# EAGLE design replicape-display (EAGLE 5.12)
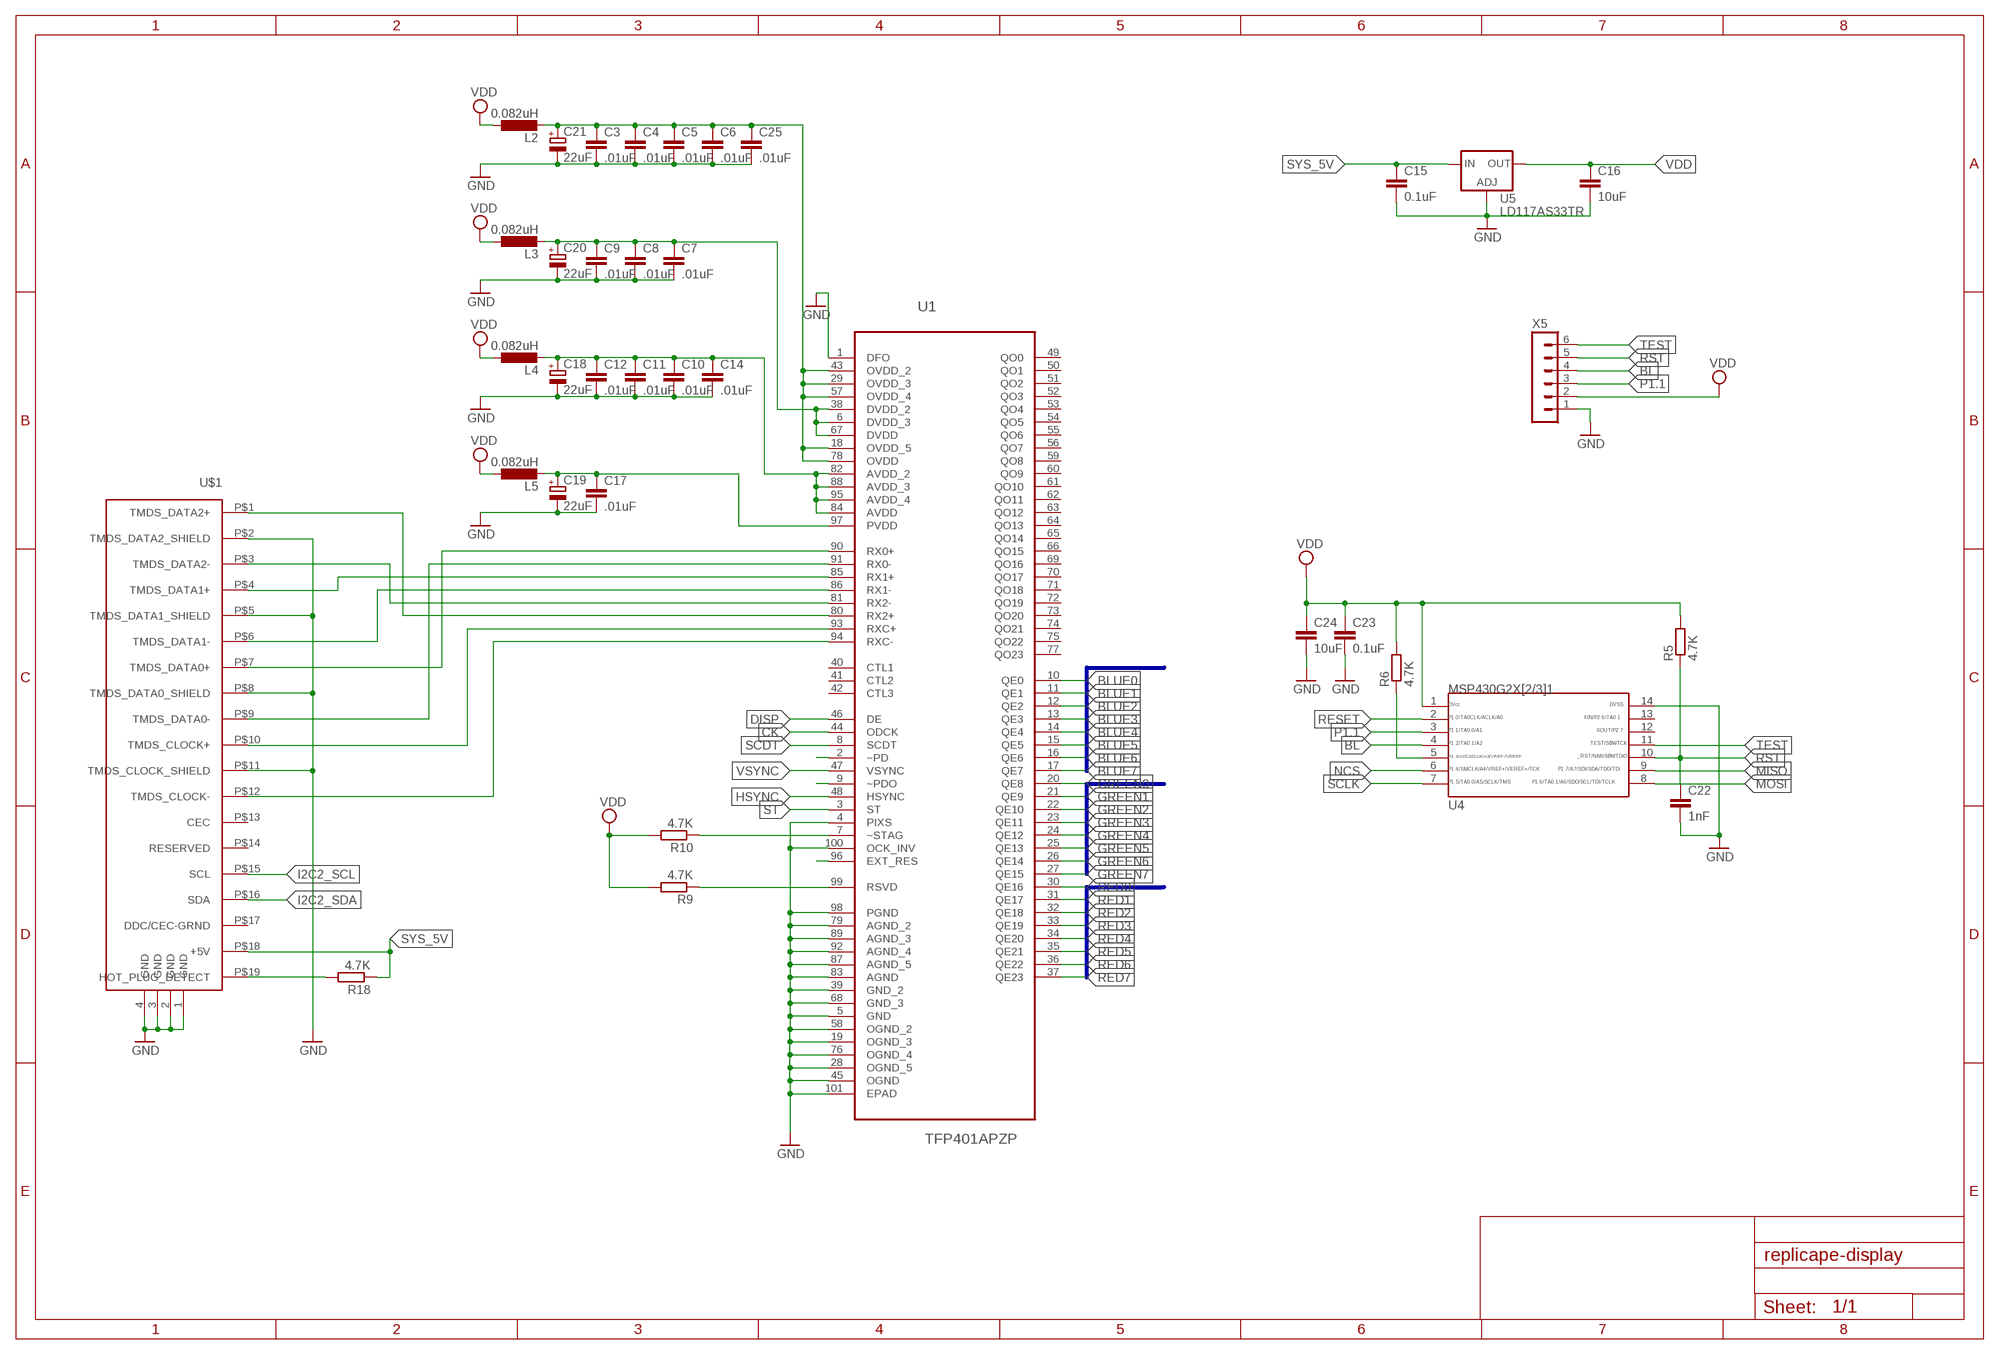
[diagram p0: schematic, sheet 1, part 1 of 2]
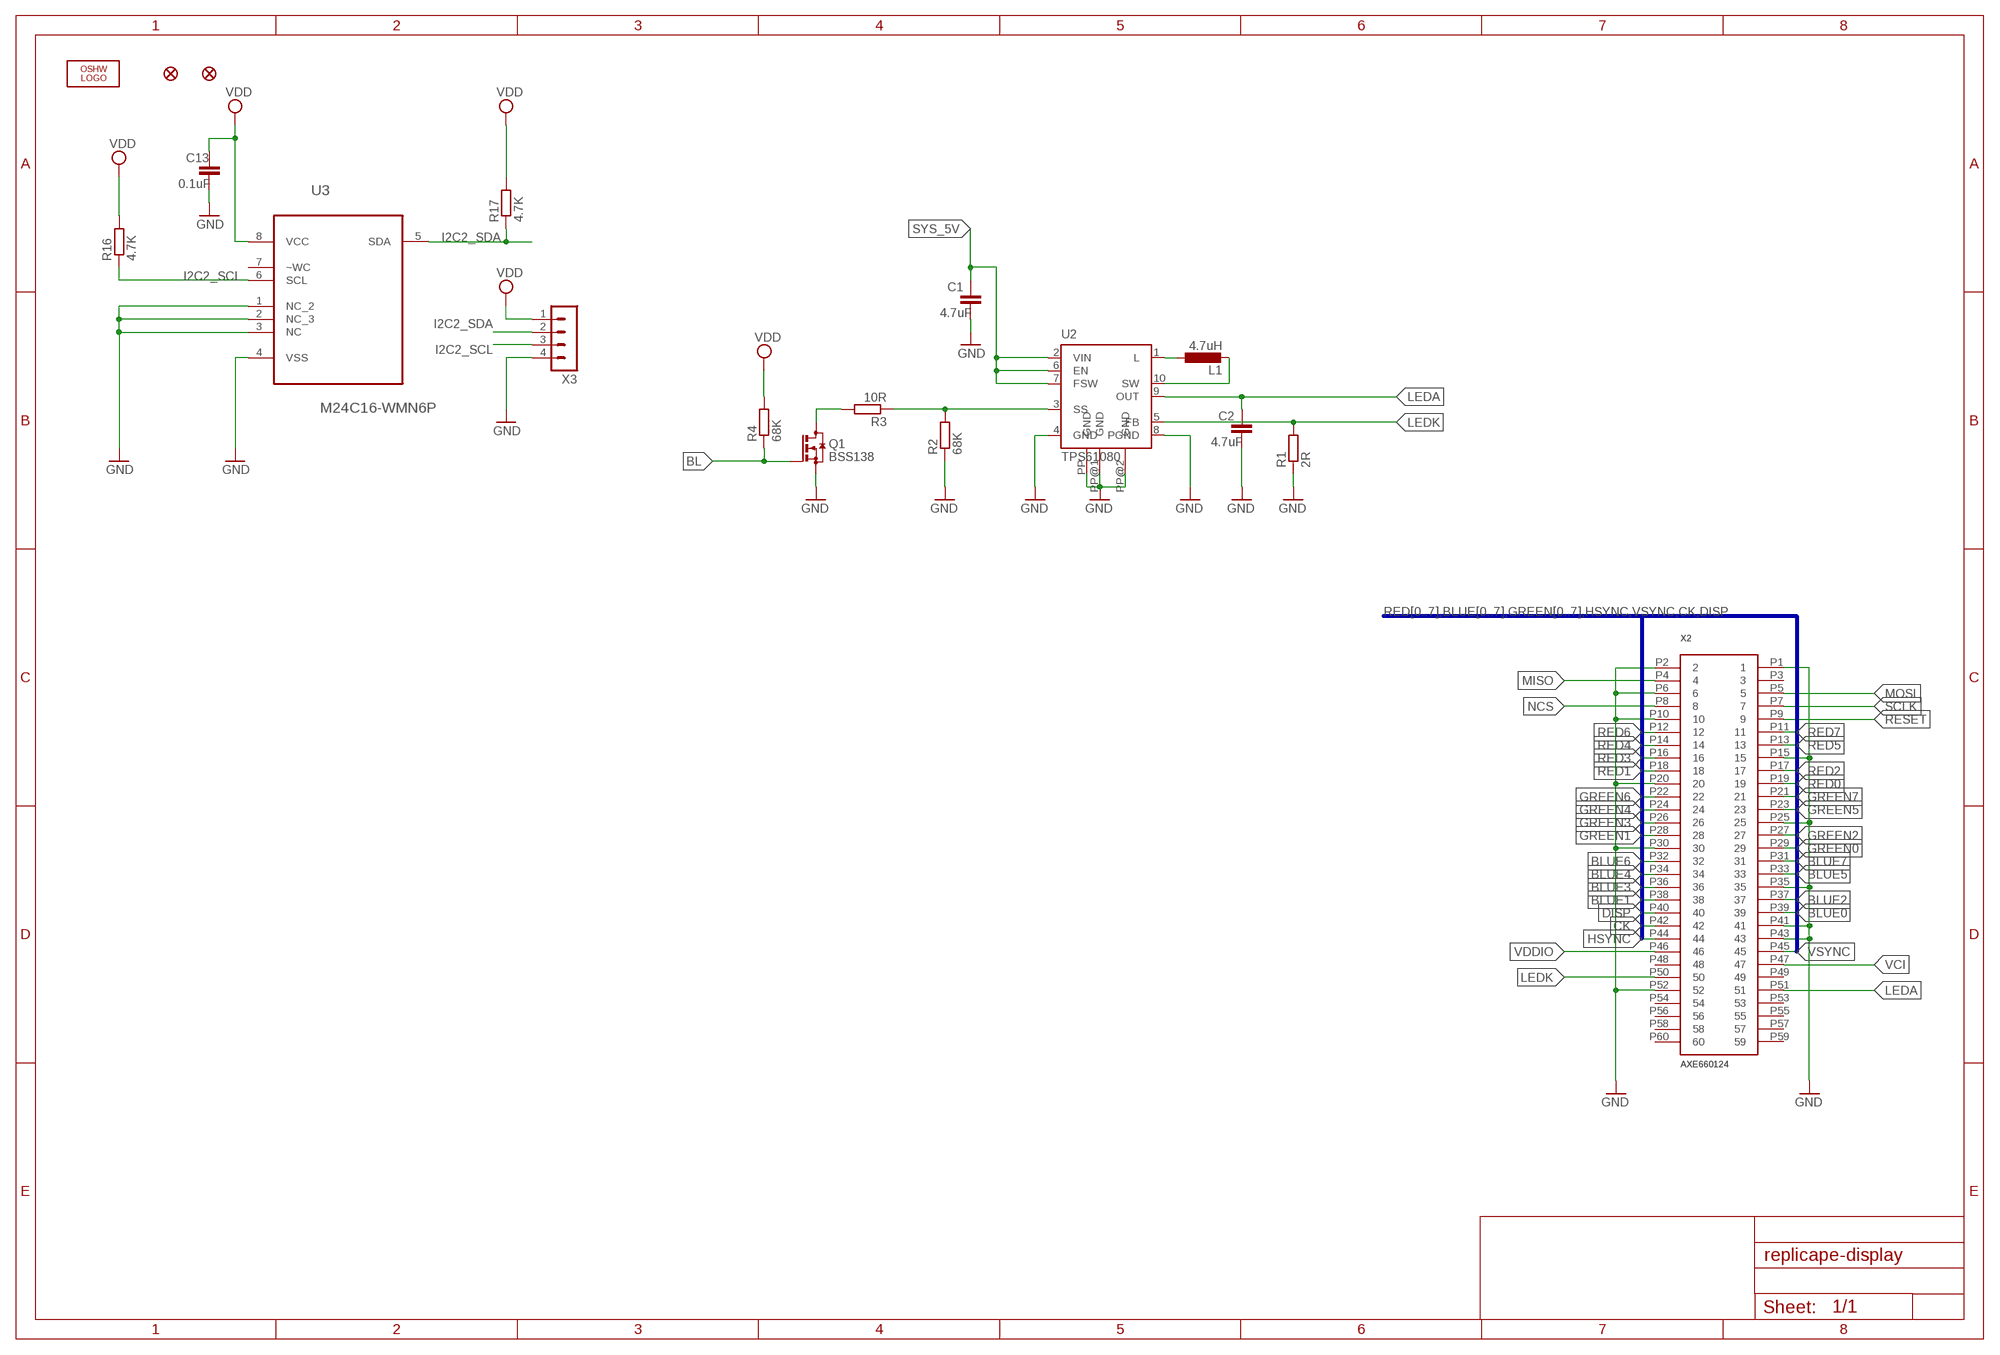
[diagram p1: schematic, sheet 1, part 2 of 2]

## Parts
C1  4.7uF  C-EUC0402  [C0402]
C2  4.7uF  C-EUC0402  [C0402]
C3  .01uF  C-EUC0402  [C0402]
C4  .01uF  C-EUC0402  [C0402]
C5  .01uF  C-EUC0402  [C0402]
C6  .01uF  C-EUC0402  [C0402]
C7  .01uF  C-EUC0402  [C0402]
C8  .01uF  C-EUC0402  [C0402]
C9  .01uF  C-EUC0402  [C0402]
C10  .01uF  C-EUC0402  [C0402]
C11  .01uF  C-EUC0402  [C0402]
C12  .01uF  C-EUC0402  [C0402]
C13  0.1uF  C-EUC0402  [C0402]
C14  .01uF  C-EUC0402  [C0402]
C15  0.1uF  C-EUC0402  [C0402]
C16  10uF  C-EUC0805  [C0805]
C17  .01uF  C-EUC0402  [C0402]
C18  22uF  CPOL-EUCT3216  [CT3216]
C19  22uF  CPOL-EUCT3216  [CT3216]
C20  22uF  CPOL-EUCT3216  [CT3216]
C21  22uF  CPOL-EUCT3216  [CT3216]
C22  1nF  C-EUC0402  [C0402]
C23  0.1uF  C-EUC0402  [C0402]
C24  10uF  C-EUC0402  [C0402]
C25  .01uF  C-EUC0402  [C0402]
JP1  FIDUCIAL1X2  [FIDUCIAL-1X2]
JP2  FIDUCIAL1X2  [FIDUCIAL-1X2]
L1  4.7uH  L-EUL2825P  [L2825P]
L2  0.082uH  L-EUL2012C  [L2012C]
L3  0.082uH  L-EUL2012C  [L2012C]
L4  0.082uH  L-EUL2012C  [L2012C]
L5  0.082uH  L-EUL2012C  [L2012C]
LOGO1  OSHW_LOGO_10MILX0500-NT  [OSHW_10X500_NOTEXT]
Q1  BSS138  BSS123  [SOT23]
R1  2R  R-EU_R0402  [R0402]
R2  68K  R-EU_R0402  [R0402]
R3  10R  R-EU_R0402  [R0402]
R4  68K  R-EU_R0402  [R0402]
R5  4.7K  R-EU_R0402  [R0402]
R6  4.7K  R-EU_R0402  [R0402]
R9  4.7K  R-EU_R0402  [R0402]
R10  4.7K  R-EU_R0402  [R0402]
R16  4.7K  R-EU_R0402  [R0402]
R17  4.7K  R-EU_R0402  [R0402]
R18  4.7K  R-EU_R0402  [R0402]
U1  TFP401APZP  [QFP50P1600X1600X120-101N]
U2  TPS61080  [S-PDSO-N10]
U3  M24C16-WMN6P  [SOIC127P600X175-8N]
U4  G2X[2/3]1---PW14  [PW14]
U5  LD117AS33TR  [SOT223]
U$1  HDMI  [FCI-HDMI]
X2  AXE660124  AXE660124SOCKET  [AXE560124]
X3  MA04-1  [MA04-1]
X5  MA06-1  [MA06-1]

## Nets
BL: Q1.1(G) R4.1 U4.4 X5.4
BLUE0: U1.10(QE0) X2.P39
BLUE1: U1.11(QE1) X2.P38
BLUE2: U1.12(QE2) X2.P37
BLUE3: U1.13(QE3) X2.P36
BLUE4: U1.14(QE4) X2.P34
BLUE5: U1.15(QE5) X2.P33
BLUE6: U1.16(QE6) X2.P32
BLUE7: U1.17(QE7) X2.P31
CK: U1.44(ODCK) X2.P42
DISP: U1.46(DE) X2.P40
GND: C1.2 C2.2 C3.2 C4.2 C5.2 C6.2 C7.2 C8.2 C9.2 C10.2 C11.2 C12.2 C13.2 C14.2 C15.2 C16.2 C17.2 C18.- C19.- C20.- C21.- C22.2 C23.2 C24.2 C25.2 Q1.2(S) R1.1 R2.1 U1.1(DFO) U1.4(PIXS) U1.5(GND) U1.19(OGND_3) U1.28(OGND_5) U1.39(GND_2) U1.45(OGND) U1.58(OGND_2) U1.68(GND_3) U1.76(OGND_4) U1.79(AGND_2) U1.83(AGND) U1.87(AGND_5) U1.89(AGND_3) U1.92(AGND_4) U1.98(PGND) U1.100(OCK_INV) U1.101(EPAD) U2.4(GND) U2.8(PGND) U2.PP(GND) U2.PP@1(GND) U2.PP@2(GND) U3.1(NC_2) U3.2(NC_3) U3.3(NC) U3.4(VSS) U4.14 U5.1(ADJ) U$1.1(GND) U$1.2(GND) U$1.3(GND) U$1.4(GND) U$1.P$2(TMDS_DATA2_SHIELD) U$1.P$5(TMDS_DATA1_SHIELD) U$1.P$8(TMDS_DATA0_SHIELD) U$1.P$11(TMDS_CLOCK_SHIELD) X2.P1 X2.P2 X2.P6 X2.P10 X2.P15 X2.P20 X2.P25 X2.P30 X2.P35 X2.P41 X2.P43 X2.P52 X3.4 X5.1
GREEN0: U1.20(QE8) X2.P29
GREEN1: U1.21(QE9) X2.P28
GREEN2: U1.22(QE10) X2.P27
GREEN3: U1.23(QE11) X2.P26
GREEN4: U1.24(QE12) X2.P24
GREEN5: U1.25(QE13) X2.P23
GREEN6: U1.26(QE14) X2.P22
GREEN7: U1.27(QE15) X2.P21
HSYNC: U1.48(HSYNC) X2.P44
I2C2_SCL: R16.1 U3.6(SCL) U$1.P$15(SCL) X3.3
I2C2_SDA: R17.1 U3.5(SDA) U$1.P$16(SDA) X3.2
LEDA: C2.1 U2.9(OUT) X2.P51
LEDK: R1.2 U2.5(FB) X2.P50
MISO: U4.9 X2.P4
MOSI: U4.8 X2.P5
N$1: L1.1 U2.1(L)
N$2: L1.2 U2.10(SW)
N$3: U1.2(~PD)
N$4: R2.2 R3.1 U2.3(SS)
N$5: U1.9(~PDO)
N$6: Q1.3(D) R3.2
N$9: R6.1 U4.5
N$10: R10.1 U1.7(~STAG)
N$11: R9.1 U1.99(RSVD)
N$19: C7.1 C8.1 C9.1 C20.+ L3.2 U1.6(DVDD_3) U1.38(DVDD_2) U1.67(DVDD)
N$20: C3.1 C4.1 C5.1 C6.1 C21.+ C25.1 L2.2 U1.18(OVDD_5) U1.29(OVDD_3) U1.43(OVDD_2) U1.57(OVDD_4) U1.78(OVDD)
N$21: C10.1 C11.1 C12.1 C14.1 C18.+ L4.2 U1.82(AVDD_2) U1.84(AVDD) U1.88(AVDD_3) U1.95(AVDD_4)
N$22: C17.1 C19.+ L5.2 U1.97(PVDD)
N$23: U1.96(EXT_RES)
N$31: R18.2 U$1.P$19(HOT_PLUG_DETECT)
NCS: U4.6 X2.P8
P1.1: U4.3 X5.3
RED0: U1.30(QE16) X2.P19
RED1: U1.31(QE17) X2.P18
RED2: U1.32(QE18) X2.P17
RED3: U1.33(QE19) X2.P16
RED4: U1.34(QE20) X2.P14
RED5: U1.35(QE21) X2.P13
RED6: U1.36(QE22) X2.P12
RED7: U1.37(QE23) X2.P11
RESET: U4.2 X2.P9
RST: C22.1 R5.1 U4.10 X5.5
SCDT: U1.8(SCDT)
SCLK: U4.7 X2.P7
ST: U1.3(ST)
SYS_5V: C1.1 C15.1 R18.1 U2.2(VIN) U2.6(EN) U2.7(FSW) U5.3(IN) U$1.P$18(+5V)
TEST: U4.11 X5.6
TMDS_CLOCK+: U1.93(RXC+) U$1.P$10(TMDS_CLOCK+)
TMDS_CLOCK-: U1.94(RXC-) U$1.P$12(TMDS_CLOCK-)
TMDS_DATA0+: U1.90(RX0+) U$1.P$7(TMDS_DATA0+)
TMDS_DATA0-: U1.91(RX0-) U$1.P$9(TMDS_DATA0-)
TMDS_DATA1+: U1.85(RX1+) U$1.P$4(TMDS_DATA1+)
TMDS_DATA1-: U1.86(RX1-) U$1.P$6(TMDS_DATA1-)
TMDS_DATA2+: U1.80(RX2+) U$1.P$1(TMDS_DATA2+)
TMDS_DATA2-: U1.81(RX2-) U$1.P$3(TMDS_DATA2-)
VCI: X2.P47
VDD: C13.1 C16.1 C23.1 C24.1 L2.1 L3.1 L4.1 L5.1 R4.2 R5.2 R6.2 R9.2 R10.2 R16.2 R17.2 U3.8(VCC) U4.1 U5.4(OUT) X3.1 X5.2
VDDIO: X2.P46
VSYNC: U1.47(VSYNC) X2.P45
Unconnected: U1.40(CTL1) U1.41(CTL2) U1.42(CTL3) U1.49(QO0) U1.50(QO1) U1.51(QO2) U1.52(QO3) U1.53(QO4) U1.54(QO5) U1.55(QO6) U1.56(QO7) U1.59(QO8) U1.60(QO9) U1.61(QO10) U1.62(QO11) U1.63(QO12) U1.64(QO13) U1.65(QO14) U1.66(QO15) U1.69(QO16) U1.70(QO17) U1.71(QO18) U1.72(QO19) U1.73(QO20) U1.74(QO21) U1.75(QO22) U1.77(QO23) U3.7(~WC) U4.12 U4.13 U$1.P$13(CEC) U$1.P$14(RESERVED) U$1.P$17(DDC/CEC-GRND) X2.P3 X2.P48 X2.P49 X2.P53 X2.P54 X2.P55 X2.P56 X2.P57 X2.P58 X2.P59 X2.P60

## Buses
RED[0..7],BLUE[0..7],GREEN[0..7],HSYNC,VSYNC,CK,DISP
RED[0..7]
GREEN[0..7]
BLUE[0..7]

## Library data of the parts
C1-C17 C22-C25 = rcl:C-EU: CAPACITOR, European symbol
C18-C21 = rcl:CPOL-EU: POLARIZED CAPACITOR, European symbol
JP1 JP2 = SparkFun:FIDUCIAL: Fiducial Alignment Points Various fiducial points for machine vision alignment.
L1-L5 = rcl:L-EU: INDUCTOR, European symbol
LOGO1 = ohw-logo:OSHW_LOGO_10MIL
Q1 = transistor-small-signal:BSS123: N-CHANNEL MOS FET
R1-R6 R9 R10 R16-R18 = rcl:R-EU_: RESISTOR, European symbol
U1 = ti-tfp401:TFP401APZP: DIGITAL RECEIVER; MPN: TFP401APZP; OC_FARNELL: 1470430; OC_NEWARK: 74K3959; PACKAGE: QFP-100; SUPPLIER: TEXAS INSTRUMENTS
U2 = texas:TPS6108*: HIGH VOLTAGE DC/DC BOOST CONVERTER WITH 0.5-A/1.3-A INTEGRATED SWITCH Source: www.ti.com .. tps61081[1].pdf; MPN: TPS61080DRCT; OC_FARNELL: 1412517; OC_NEWARK: 30M1831
U3 = custom:M24C16-WMN6P: serial I²C bus EEPROM; MPN: M24C16-WMN6P; OC_FARNELL: 9882774; OC_NEWARK: 24M5071; PACKAGE: SOIC-8; SUPPLIER: STMicroelectronics
U4 = TI_MSP430_v16:G2X[2/3]1---PW14: MSP430G2X[2/3]1 TSSOP (PW) 14 Pin Package http://focus.ti.com/docs/prod/folders/print/msp430g2221.html MSP430G2121, MSP430G2221, MSP430G2131
U5 = v-reg:LD117A?*: Low drop fixed and adjustable positive voltage regulators 1 A Source: http://www.st.com/stonline/products/literature/ds/7194/ld1117axx.pdf
U$1 = hdmi:HDMI
X2 = replicape-display:AXE660124
X3 = con-lstb:MA04-1: PIN HEADER; OC_FARNELL: unknown; OC_NEWARK: unknown
X5 = con-lstb:MA06-1: PIN HEADER; OC_FARNELL: unknown; OC_NEWARK: unknown

## Board
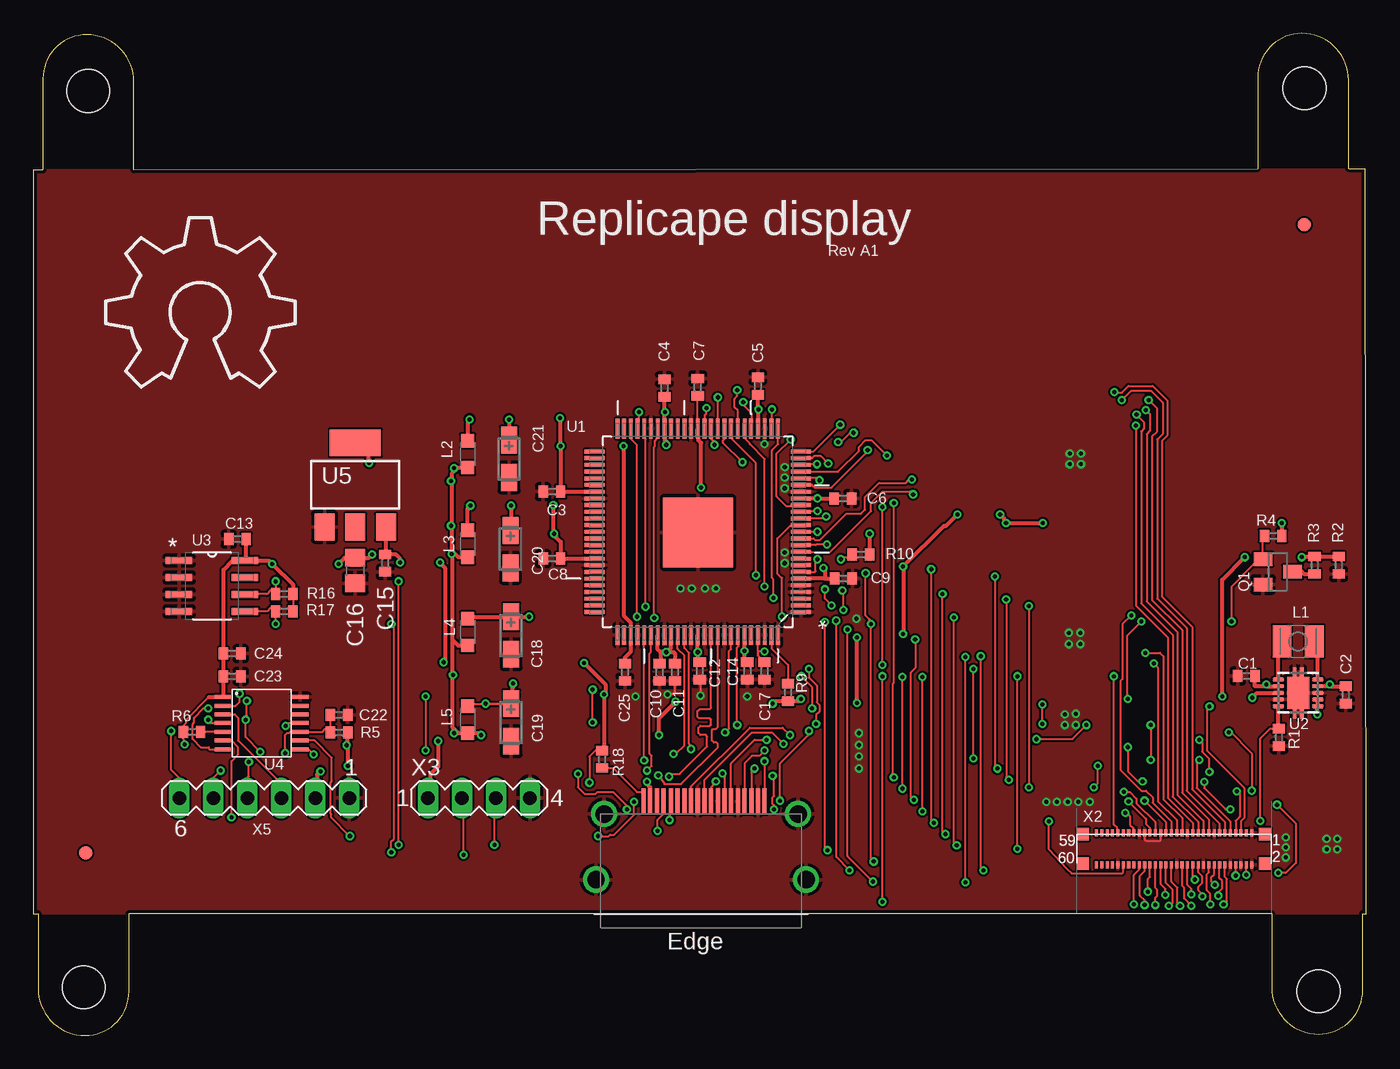
[diagram p2: board, top side]
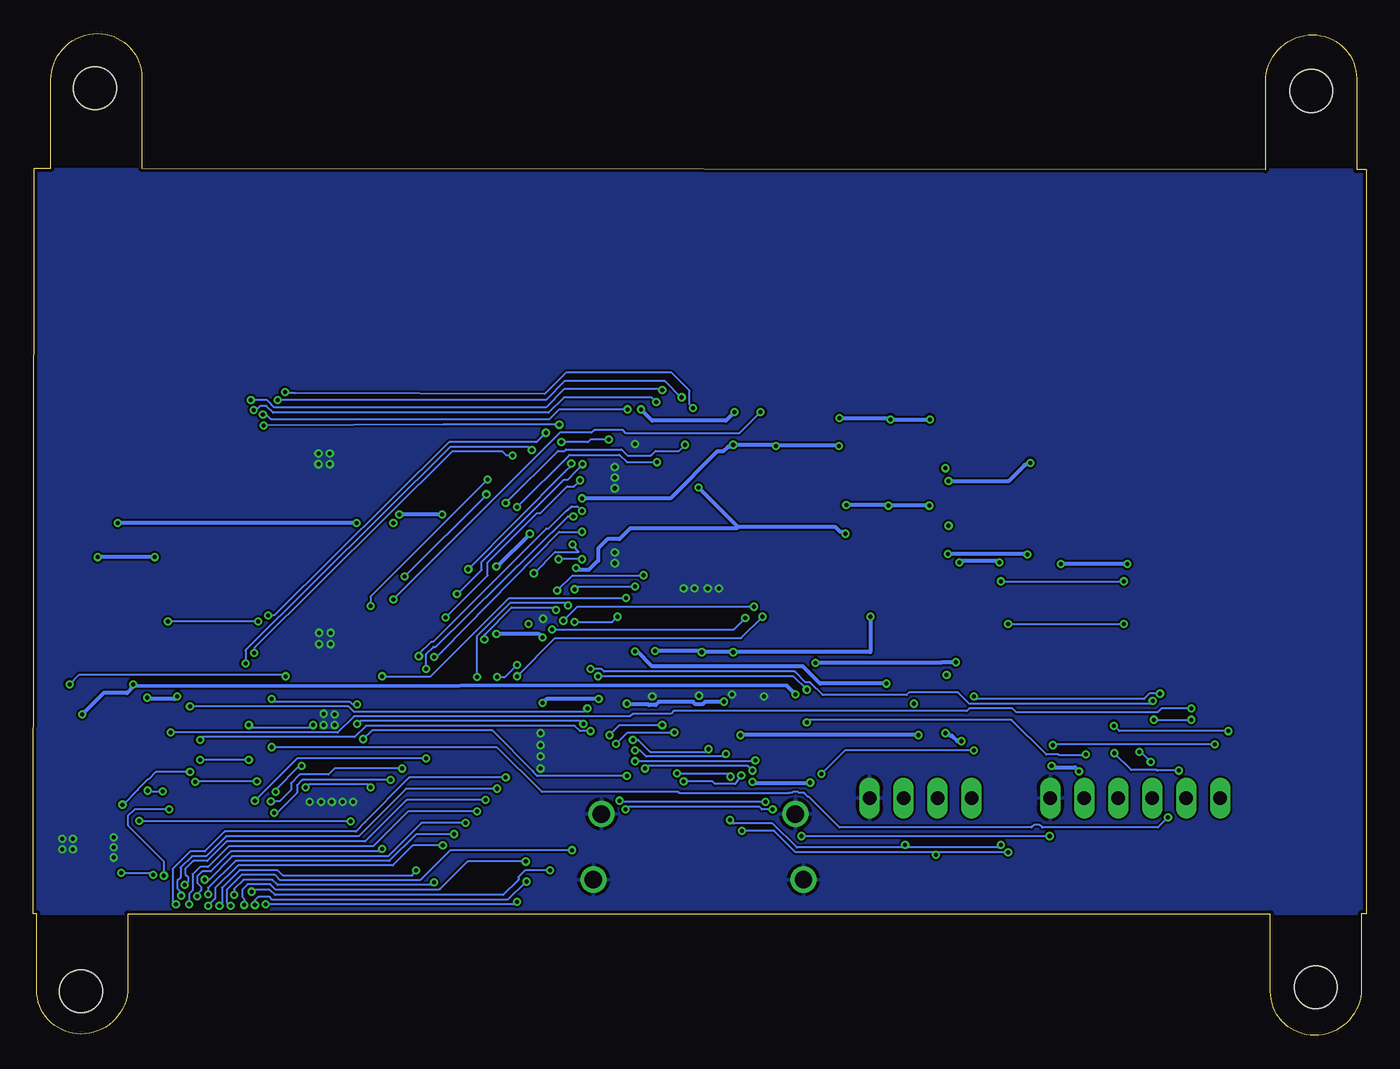
[diagram p3: board, bottom side, seen from below]

Size 99.6 x 74.9 mm. Coordinates in mm from the lower left corner, seen from the top.
Outline: 0,9.1 0.35,9.1 0.35,3.5 arc90 3.85,0 arc90 7.15,3.3 7.15,9.1 92.55,9.1 92.55,3.6 arc90 96.05,0.1 arc90 99.35,3.4 99.35,9.1 99.6,9.1 99.55,64.8 98.3,64.8 98.3,71.4 arc90 94.8,74.9 arc90 91.5,71.6 91.5,64.8 7.5,64.7 7.5,71.3 arc90 4,74.8 arc90 0.7,71.5 0.7,64.7 0,64.7 0,9.1
Copper layers (1*16): Top 0.035mm / dielectric 1.5mm / Bottom 0.035mm
Design rules "Fusion_eagle_rule_v1.1": minimum track width 6mil, minimum drill 12mil, track to track 6mil, track to pad 6mil, pad to pad 6mil, via to via 6mil, smd to smd 0mil, copper to edge 10mil, drill to drill 10mil, minimum pad ring 10mil, minimum via ring 6mil, stop-mask expansion 2mil, vias tented up to drill 100mil, thermal gap 10mil
Holes 3.2 mm at 4.1,70.6 3.75,3.6 95,70.8 96.05,3.3

### Footprints (pad centres in the part's own frame; a part is rotated, then mirrored left to right if it is on the bottom)
C0402 = smd 0.7 x 0.9: 1 -0.65,0; 2 0.65,0
C0805 = smd 1.3 x 1.5: 1 -0.95,0; 2 0.95,0
CT3216 = smd 2 x 1.2: + -1.4,0; - 1.4,0
FIDUCIAL-1X2 = smd 1 x 1: 1 0,0
L2825P = smd 1.4 x 2.4: 1 -1.2,0; 2 1.2,0
L2012C = smd 1 x 1: 1 -1,0; 2 1,0
SOT23 = smd 1 x 1.4: 1 -0.95,-1.1; 2 0.95,-1.1; 3 0,1.1
R0402 = smd 0.7 x 0.9: 1 -0.65,0; 2 0.65,0
QFP50P1600X1600X120-101N = smd 1.473 x 0.279: 1 -7.722,5.994; 2 -7.722,5.512; 3 -7.722,5.004; 4 -7.722,4.496; 5 -7.722,3.988; 6 -7.722,3.505; 7 -7.722,2.997; 8 -7.722,2.489; 9 -7.722,2.007; 10 -7.722,1.499; 11 -7.722,0.991; 12 -7.722,0.508; 13 -7.722,0; 14 -7.722,-0.508; 15 -7.722,-0.991; 16 -7.722,-1.499; 17 -7.722,-2.007; 18 -7.722,-2.489; 19 -7.722,-2.997; 20 -7.722,-3.505; 21 -7.722,-3.988; 22 -7.722,-4.496; 23 -7.722,-5.004; 24 -7.722,-5.512; 25 -7.722,-5.994; 51 7.722,-5.994; 52 7.722,-5.512; 53 7.722,-5.004; 54 7.722,-4.496; 55 7.722,-3.988; 56 7.722,-3.505; 57 7.722,-2.997; 58 7.722,-2.489; 59 7.722,-2.007; 60 7.722,-1.499; 61 7.722,-0.991; 62 7.722,-0.508; 63 7.722,0; 64 7.722,0.508; 65 7.722,0.991; 66 7.722,1.499; 67 7.722,2.007; 68 7.722,2.489; 69 7.722,2.997; 70 7.722,3.505; 71 7.722,3.988; 72 7.722,4.496; 73 7.722,5.004; 74 7.722,5.512; 75 7.722,5.994 | smd 0.279 x 1.473: 26 -5.994,-7.722; 27 -5.512,-7.722; 28 -5.004,-7.722; 29 -4.496,-7.722; 30 -3.988,-7.722; 31 -3.505,-7.722; 32 -2.997,-7.722; 33 -2.489,-7.722; 34 -2.007,-7.722; 35 -1.499,-7.722; 36 -0.991,-7.722; 37 -0.508,-7.722; 38 0,-7.722; 39 0.508,-7.722; 40 0.991,-7.722; 41 1.499,-7.722; 42 2.007,-7.722; 43 2.489,-7.722; 44 2.997,-7.722; 45 3.505,-7.722; 46 3.988,-7.722; 47 4.496,-7.722; 48 5.004,-7.722; 49 5.512,-7.722; 50 5.994,-7.722; 76 5.994,7.722; 77 5.512,7.722; 78 5.004,7.722; 79 4.496,7.722; 80 3.988,7.722; 81 3.505,7.722; 82 2.997,7.722; 83 2.489,7.722; 84 2.007,7.722; 85 1.499,7.722; 86 0.991,7.722; 87 0.508,7.722; 88 0,7.722; 89 -0.508,7.722; 90 -0.991,7.722; 91 -1.499,7.722; 92 -2.007,7.722; 93 -2.489,7.722; 94 -2.997,7.722; 95 -3.505,7.722; 96 -3.988,7.722; 97 -4.496,7.722; 98 -5.004,7.722; 99 -5.512,7.722; 100 -5.994,7.722 | smd 5.207 x 5.207: 101 -0.025,0.051
S-PDSO-N10 = smd 0.28 x 0.85: 1 -1,-1.475; 2 -0.5,-1.475; 3 0,-1.475; 4 0.5,-1.475; 5 1,-1.475; 6 1,1.475; 7 0.5,1.475; 8 0,1.475; 9 -0.5,1.475; 10 -1,1.475 | smd 2.4 x 1.65: PP 0,0 | smd 3.8 x 0.28: PP@1 0,0.275; PP@2 0,-0.275
SOIC127P600X175-8N = smd 1.981 x 0.533: 1 -2.464,1.905; 2 -2.464,0.635; 3 -2.464,-0.635; 4 -2.464,-1.905; 5 2.464,-1.905; 6 2.464,-0.635; 7 2.464,0.635; 8 2.464,1.905
PW14 = smd 0.3 x 1.2: 1 -1.95,-2.9; 2 -1.3,-2.9; 3 -0.65,-2.9; 4 0,-2.9; 5 0.65,-2.9; 6 1.3,-2.9; 7 1.95,-2.9; 8 1.95,2.9; 9 1.3,2.9; 10 0.65,2.9; 11 0,2.9; 12 -0.65,2.9; 13 -1.3,2.9; 14 -1.95,2.9
SOT223 = smd 1.5 x 2: 1 -2.3,-3.15; 2 0,-3.15; 3 2.3,-3.15 | smd 3.8 x 2: 4 0,3.15
FCI-HDMI = drill 1.3 round: 1 1.1,7.85; 2 -3.8,7.25; 3 1.1,-7.85; 4 -3.8,-7.25 | smd 1.9 x 0.3: P$1 -4.76,4.75; P$2 -4.76,4.25; P$3 -4.76,3.75; P$4 -4.76,3.25; P$5 -4.76,2.75; P$6 -4.76,2.25; P$7 -4.76,1.75; P$8 -4.76,1.25; P$9 -4.76,0.75; P$10 -4.76,0.25; P$11 -4.76,-0.25; P$12 -4.76,-0.75; P$13 -4.76,-1.25; P$14 -4.76,-1.75; P$15 -4.76,-2.25; P$16 -4.76,-2.8; P$17 -4.76,-3.3; P$18 -4.76,-3.8; P$19 -4.76,-4.3
AXE560124 = smd 0.9 x 0.92: 1 -6.8,1.1; 2 -6.8,-1.1; 3 6.8,1.1; 4 6.8,-1.1 | smd 0.23 x 0.5: P1 5.8,1.2; P2 5.8,-1.2; P3 5.4,1.2; P4 5.4,-1.2; P5 5,1.2; P6 5,-1.2; P7 4.6,1.2; P8 4.6,-1.2; P9 4.2,1.2; P10 4.2,-1.2; P11 3.8,1.2; P12 3.8,-1.2; P13 3.4,1.2; P14 3.4,-1.2; P15 3,1.2; P16 3,-1.2; P17 2.6,1.2; P18 2.6,-1.2; P19 2.2,1.2; P20 2.2,-1.2; P21 1.8,1.2; P22 1.8,-1.2; P23 1.4,1.2; P24 1.4,-1.2; P25 1,1.2; P26 1,-1.2; P27 0.6,1.2; P28 0.6,-1.2; P29 0.2,1.2; P30 0.2,-1.2; P31 -0.2,1.2; P32 -0.2,-1.2; P33 -0.6,1.2; P34 -0.6,-1.2; P35 -1,1.2; P36 -1,-1.2; P37 -1.4,1.2; P38 -1.4,-1.2; P39 -1.8,1.2; P40 -1.8,-1.2; P41 -2.2,1.2; P42 -2.2,-1.2; P43 -2.6,1.2; P44 -2.6,-1.2; P45 -3,1.2; P46 -3,-1.2; P47 -3.4,1.2; P48 -3.4,-1.2; P49 -3.8,1.2; P50 -3.8,-1.2; P51 -4.2,1.2; P52 -4.2,-1.2; P53 -4.6,1.2; P54 -4.6,-1.2; P55 -5,1.2; P56 -5,-1.2; P57 -5.4,1.2; P58 -5.4,-1.2; P59 -5.8,1.2; P60 -5.8,-1.2
MA04-1 = drill 1.016 long: 1 -3.81,0; 2 -1.27,0; 3 1.27,0; 4 3.81,0
MA06-1 = drill 1.016 long: 1 -6.35,0; 2 -3.81,0; 3 -1.27,0; 4 1.27,0; 5 3.81,0; 6 6.35,0

### Placement (x,y rotation side)
C1  90.66,26.87 180 top
C2  98.08,25.46 270 top
C3  38.75,40.65 180 top
C4  47.15,48.4 90 top
C5  54.15,48.55 90 top
C6  60.5,40.15 0 top
C7  49.65,48.45 90 top
C8  38.75,35.65 180 top
C9  60.55,34.15 0 top
C10  46.8,27.15 270 top
C11  47.95,27.15 270 top
C12  49.8,27.25 270 top
C13  15.25,37.1 180 top
C14  53.35,27.25 270 top
C15  26.3,35.3 270 top
C16  24.05,34.75 270 top
C17  54.65,27.25 270 top
C18  35.7,29.9 270 top
C19  35.7,23.4 270 top
C20  35.65,36.35 270 top
C21  35.55,43.1 270 top
C22  22.85,23.95 0 top
C23  14.85,26.85 0 top
C24  14.85,28.55 0 top
C25  44.2,27.15 270 top
JP1  3.9,13.65 0 top
JP2  95,60.6 0 top
L1  94.53,29.46 0 top
L2  32.45,43.45 90 top
L3  32.45,36.75 90 top
L4  32.45,30.15 90 top
L5  32.45,23.6 90 top
LOGO1  5.4,48.45 0 top
Q1  93,34.65 270 top
R1  93.09,22.28 90 top
R2  97.55,35.15 90 top
R3  95.75,35.15 270 top
R4  92.65,37.35 0 top
R5  22.85,22.65 0 top
R6  11.85,22.7 180 top
R9  56.4,25.65 270 top
R10  61.85,35.95 0 top
R16  18.75,33 0 top
R17  18.75,31.7 0 top
R18  42.5,20.65 270 top
U1  49.65,37.65 180 top
U2  94.53,25.61 270 top
U3  13.35,33.6 0 top
U4  17.05,23.35 270 top
U5  24.05,41.15 0 top
U$1  49.9,12.75 270 top
X2  85.25,13.95 0 top
X3  33.3,17.75 0 top
X5  17.25,17.75 180 top

### Tracks (layer width: path | path; a pad name or v marks a point on that pad's centre or on a via)
BL  (via drill 0.3)
  Top 0.152: R4.1 91.9,37.25 Q1.1 91.3,35.6 91.3,35.3 89.55,33.55 v89.55,30.95 | v16.1,20.45 16.1,19.35 16,19.25 16,17.75 X5.4 | v16.95,21.2 15.85,22.3 v15.85,23.6 15.9,23.65 15.9,23.85 15.95,23.9 v15.95,25 | v13.05,23.6 13.05,23.55 13.25,23.35 U4.4 | v82.8,30.95 81.75,29.9 81.75,25.2 v81.8,25.15 | v75.4,23.3 v75.4,24.75 | v58.5,23.3 58.5,23.95 58.75,24.2 58.75,24.7 58.55,24.9 58.55,26.15 57.95,26.75 v57.95,27.4
  Bottom 0.152: v16.1,20.45 16.85,21.2 v16.95,21.2 | v15.85,23.6 v13.05,23.6 | v82.8,30.95 v89.55,30.95 | v81.8,25.15 81.6,24.95 75.95,24.95 75.75,24.75 v75.4,24.75 | v75.4,23.3 75.2,23.5 58.7,23.5 v58.5,23.3 | v57.95,27.4 57.15,27.4 56.95,27.2 42.7,27.2 41.9,26.4 41.55,26.4 40.6,25.45 34.35,25.45 34.15,25.65 30.5,25.65 29.65,24.8 16.15,24.8 v15.95,25
BLUE0  (via drill 0.3)
  Top 0.152: X2.P39 83.45,15.5 83.15,15.8 83.15,16.2 v81.85,17.5 | v72.05,19.95 71.85,20.15 v71.85,34.3 | U1.10 57.4,36.15 59.55,36.15 62.6,39.2 62.6,39.8 63.45,40.65 65.55,40.65 v65.75,40.45
  Bottom 0.152: v81.85,17.5 81.2,17.5 80.35,18.35 80.35,18.85 79.7,19.5 77.55,19.5 77.1,19.95 v72.05,19.95 | v65.75,40.45 65.75,40.4 v71.85,34.3
BLUE1  (via drill 0.3)
  Top 0.152: X2.P38 83.85,11.05 84,10.9 84,10.45 83.85,10.3 v83.85,9.75 | v62.8,13 62.6,13.2 v62.6,30.75 62.55,30.8 62.55,31 62.5,31.05 62.5,31.1 62.2,31.4 v62.2,34.55 | 57.4,36.65 U1.11 57.45,36.65 58.45,36.65 58.55,36.7 v59.3,36.7
  Bottom 0.152: v83.85,9.75 83.85,10.2 84,10.35 84,10.9 83.6,11.3 81.9,11.3 81.5,10.9 69.3,10.9 69.25,10.95 69.2,10.95 67.15,13 v62.8,13 | v59.3,36.7 58.85,36.15 60.6,36.15 v62.2,34.55
BLUE2  (via drill 0.3)
  Top 0.152: X2.P37 83.85,15.95 82.45,17.35 82.45,17.7 81.95,18.2 v81.5,18.2 | v74.4,32.1 v74.4,18.55 | v79.25,18.55 79.55,18.85 v79.55,20.15 | U1.12 57.4,37.15 58.3,37.15 58.4,37.05 58.8,37.05 60.75,39 61.85,39 62.15,39.3 62.15,40.25 63.2,41.3 65.2,41.3 65.45,41.55 v65.65,41.55
  Bottom 0.152: v81.5,18.2 81.5,18.35 79.75,20.15 v79.55,20.15 | v74.4,18.55 74.6,18.75 79.05,18.75 v79.25,18.55 | v74.4,32.1 74.4,32.8 v65.65,41.55
BLUE3  (via drill 0.3)
  Top 0.152: X2.P36 84.25,11.3 84.6,10.95 v84.6,10.5 | v58.6,37.65 U1.13 | v69.65,11.45 v69.65,28.3
  Bottom 0.152: v84.6,10.5 84.6,10.95 83.9,11.65 81.75,11.65 81.35,11.25 69.85,11.25 v69.65,11.45 | v58.6,37.65 60.3,37.65 69.05,28.7 69.45,28.3 v69.65,28.3
BLUE4  (via drill 0.3)
  Top 0.152: X2.P34 84.65,11.4 85.15,10.9 85.15,9.95 v84.85,9.7 | v55.95,31.3 55.95,34.2 55.9,34.2 55.6,34.5 55.6,37.15 56.6,38.15 57.35,38.15 U1.14 | v59.15,30.9 59.15,14.05 v59.35,13.85
  Bottom 0.152: v84.85,9.7 85.15,9.95 85.15,10.9 84.05,12 81.55,12 81.15,11.6 70.7,11.6 68.45,13.85 v59.35,13.85 | v55.95,31.3 56.35,30.9 v59.15,30.9
BLUE5  (via drill 0.3)
  Top 0.152: U1.15 59.09,38.64 v59.25,38.8 | v70.25,20.7 v70.25,27.4 | v83.05,17.55 84.65,15.95 X2.P33
  Bottom 0.152: v59.25,38.8 59.65,38.8 69.55,29.05 69.7,29.05 70.25,28.5 v70.25,27.4 | v70.25,20.7 79.9,20.7 v83.05,17.55
BLUE6  (via drill 0.3)
  Top 0.152: X2.P32 85.05,11.5 85.5,11.05 85.5,9.9 v85.7,9.7 | v58.6,39.2 58.55,39.15 57.4,39.15 U1.16 | v70.8,28.35 70.8,12.4 v71,12.35
  Bottom 0.152: v85.7,9.7 85.5,9.9 85.5,11.05 84.2,12.35 81.35,12.35 80.95,11.95 71.3,11.95 v71,12.35 | v58.6,39.2 58.95,39.55 59.4,39.55 59.8,39.2 61.1,37.9 61.25,37.9 69.7,29.45 69.85,29.45 70.8,28.5 v70.8,28.35
BLUE7  (via drill 0.3)
  Top 0.152: v56.6,44.55 55.55,43.5 55.55,40.3 56.3,39.55 56.5,39.55 56.6,39.65 57.35,39.65 U1.17 | v60.15,44.35 60.35,44.35 61.05,45.05 v61.3,45.05 | X2.P31 85.05,16 83.65,17.4 83.65,17.8 83.15,18.3 82.8,18.3 81.25,19.85 81.25,26.5 81.4,26.65 81.4,30.75 v82.05,31.4
  Bottom 0.152: v56.6,44.55 57.95,44.55 58.15,44.35 v60.15,44.35 | v61.3,45.05 62,44.35 68.55,44.35 81.5,31.5 81.6,31.4 v82.05,31.4
CK  (via drill 0.3)
  Top 0.152: X2.P42 83.05,12.3 82.7,11.95 82.7,10.45 83.05,10.1 v83.05,9.75 | v46.4,31.2 46.4,44 46.45,44.05 46.45,44.45 46.65,44.65 46.65,45.35 U1.44 | v60.85,30.35 60.85,13.4 v62.75,11.5
  Bottom 0.152: v83.05,9.75 83.05,10.1 82.8,10.35 81.95,10.35 81.75,10.15 64.15,10.15 62.8,11.5 v62.75,11.5 | v46.4,31.2 47.25,30.35 v60.85,30.35
DISP  (via drill 0.3)
  Top 0.152: v83.3,10.75 83.3,11.7 83.45,11.85 X2.P40 | v45.75,32.05 45.75,44.55 45.65,44.65 45.65,45.35 U1.46 | v60,31 60,13.35 v61,12.35
  Bottom 0.152: v83.3,10.75 83.3,10.9 81.95,10.9 81.55,10.5 64.5,10.5 63.35,11.65 63.35,11.85 62.85,12.35 v61,12.35 | v45.75,32.05 58.95,32.05 v60,31
GND  (via drill 0.3)
  Top 0.152: C12.2 49.85,26.6 v49.85,25.4 | C11.2 47.95,25.55 47.4,25.55 v47.4,25.5 | X2.P41 83.05,14.65 83.15,14.55 84.2,14.55 84.25,14.6 X2.P35
  Bottom 0.152: v49.85,25.4 49.8,25.4 49.8,25.6 | v47.4,25.5 47.45,25.5 47.45,25.2
  other vias: 53.35,25.35 56.15,40.9 56.15,41.7 56.15,42.5 54.65,44.2 76.5,17.45 77.3,17.45 78.1,17.45 78.95,17.45 75.7,17.45 61.5,31.15 56.15,35.3 56.15,36.1 49.2,33.4 50.2,33.4 51,33.4 48.35,33.4 61.7,22.6 61.7,21.7 61.7,20.85 61.7,19.95 77.1,24 77.9,24.05 77.1,23.2 77.9,23.2 97.45,14.7 96.65,14.7 96.65,13.9 97.45,13.9 77.4,30.1 78.25,30.1 78.25,29.25 77.4,29.25 77.45,43.5 78.3,43.5 78.3,42.7 77.45,42.7 93.6,14.8 93.6,14.05 93.6,13.3 45,25.35
  pour Bottom: 0,64.7 99.55,64.8 99.85,9.1 0,9.1
  pour Top: 0,64.7 99.55,64.8 99.85,9.1 0,9.1
GREEN0  (via drill 0.3)
  Top 0.152: v62.35,43.75 62.35,43.65 59.65,40.95 58.4,40.95 58.2,41.15 57.4,41.15 U1.20 | X2.P29 85.45,16.1 84.05,17.5 84.05,27.5 v83.75,27.8
  Bottom 0.152: v62.35,43.75 62.6,44 68.45,44 83.75,28.8 v83.75,27.8
GREEN1  (via drill 0.3)
  Top 0.152: X2.P28 85.85,11.2 86,11.05 86,10.25 v86.55,9.7 | v58.75,41.5 58.6,41.65 57.4,41.65 U1.21 | v68.8,31.25 68.8,14.4 v69,14.2
  Bottom 0.152: v86.55,9.7 86,10.25 86,11.05 84.3,12.7 72.75,12.7 71.25,14.2 v69,14.2 | v58.75,41.5 59.2,41.05 59.7,41.05 61.7,39.05 61.95,39.05 65.65,35.35 65.65,34.4 v68.8,31.25
GREEN2  (via drill 0.3)
  Top 0.152: X2.P27 85.85,16.25 84.45,17.65 84.45,28.35 84.2,28.6 v83.1,28.6 | U1.22 60.15,42.15 61.7,43.7 61.7,44 62.2,44.5 62.65,44.5 v63.8,43.35
  Bottom 0.152: v83.1,28.6 83.1,28.95 68.3,43.65 64.55,43.65 64.25,43.35 v63.8,43.35
GREEN3  (via drill 0.3)
  Top 0.152: X2.P26 86.25,11.25 86.55,10.95 v86.55,10.55 | v58.55,42.7 57.4,42.65 U1.23 | v67.95,33 67.95,15.25 v68.15,15.05
  Bottom 0.152: v86.55,10.55 86.55,11.05 84.5,13.05 73,13.05 71,15.05 v68.15,15.05 | v58.55,42.7 59.65,41.55 59.95,41.55 66.1,35.4 66.1,34.8 67.9,33 v67.95,33
GREEN4  (via drill 0.3)
  Top 0.152: X2.P24 86.65,11.75 v86.8,11.65 | v59.4,42.75 58.85,43.3 58.35,43.3 58.2,43.15 57.4,43.15 U1.24 | v67.1,34.85 67.1,16.1 v67.3,15.9
  Bottom 0.152: v86.8,11.65 86.45,11.65 84.75,13.4 73.1,13.4 70.6,15.9 v67.3,15.9 | v59.4,42.75 59.4,42.6 59.85,42.15 v67.1,34.85
GREEN5  (via drill 0.3)
  Top 0.152: X2.P23 86.65,15.9 84.8,17.75 84.8,29.75 82.4,32.15 v82.4,45.6 | U1.25 58.29,43.64 v60.3,45.65
  Bottom 0.152: v60.3,45.65 68.95,45.65 v82.4,45.6
GREEN6  (via drill 0.3)
  Top 0.152: v87.35,10.4 87.35,10.55 87.05,10.85 87.05,11.1 87.35,11.4 87.35,11.9 87.05,12.2 X2.P22 | v55.3,32.7 55.3,34.1 55.2,34.2 55.2,43.75 55.65,44.2 55.65,45.35 U1.26 | v73.55,13.95 v73.55,26.85
  Bottom 0.152: v87.35,10.4 87.35,10.55 87.05,10.85 87.05,11.1 87.35,11.4 87.35,11.9 87,12.25 86.35,12.25 84.85,13.75 73.75,13.75 v73.55,13.95 | v55.3,32.7 64.05,32.7 69.9,26.85 v73.55,26.85
GREEN7  (via drill 0.3)
  Top 0.152: X2.P21 87.05,15.95 85.15,17.85 85.15,29.95 82.8,32.3 82.8,45.15 83,45.35 83,45.85 v82.45,46.4 | v55.2,46.8 55.2,45.41 U1.27
  Bottom 0.152: v82.45,46.4 82.2,46.4 81.85,46.05 61.05,46.05 60.3,46.8 v55.2,46.8
HSYNC  (via drill 0.3)
  Top 0.152: X2.P44 82.65,12.4 82.25,12 v82.25,9.8 | v45.1,31.3 45.1,44.15 44.65,44.6 44.65,45.35 U1.48 | v63.45,10 v63.45,26.85
  Bottom 0.152: v82.25,9.8 63.7,9.8 63.5,10 v63.45,10 | v45.1,31.3 46.7,29.7 60.6,29.7 v63.45,26.85
I2C2_SCL  (via drill 0.3)
  Top 0.152: U3.6 15.85,32.95 16.75,32.95 16.8,33 17.45,33 17.7,33.25 18.1,33.25 R16.1 v18.1,33.95 | v47.55,16.1 47.55,16.45 47.65,16.55 U$1.P$15 | v27.3,14.25 v27.3,33.95 | v34.45,14.25 34.45,16.65 34.55,16.75 34.55,17.75 X3.3
  Bottom 0.152: v47.55,16.1 47.3,15.85 44.35,15.85 42.55,14.05 34.45,14.05 | 34.45,14.05 27.5,14.05 v27.3,14.25 | v27.3,33.95 v18.1,33.95 | 34.45,14.05 v34.45,14.25
I2C2_SDA  (via drill 0.3)
  Top 0.152: U3.5 15.85,31.7 17.45,31.7 17.7,31.95 18.1,31.95 R17.1 v18.1,30.75 | v26.75,30.75 26.95,30.55 26.95,14.7 26.75,14.5 v26.75,13.7 | v46.65,15.3 46.65,16.1 47.1,16.55 U$1.P$16 | v32.15,13.5 32.15,16.65 32.05,16.75 32.05,17.75 X3.2
  Bottom 0.152: v26.75,30.75 v18.1,30.75 | v26.75,13.7 32.15,13.7 | 32.15,13.7 42.65,13.7 44.25,15.3 v46.65,15.3 | 32.15,13.7 v32.15,13.5
LEDA  (via drill 0.3)
  Top 0.152: v80.75,26.85 80.75,15.75 81,15.5 81,15.45 81.05,15.4 X2.P51 | v96.9,26.25 96.9,26.11
  Top 0.3: C2.1 96.9,26.11 U2.9
  Bottom 0.152: v96.9,26.25 96.2,26.95 80.85,26.95 v80.75,26.85
LEDK  (via drill 0.3)
  Top 0.152: X2.P50 81.45,12.2 81.35,12.1 77.6,12.1 77.25,12.45 75.9,13.9 v75.9,16 | v91.7,16.05 91.7,22.2 92.45,22.95 92.9,22.95 R1.2
  Top 0.3: U2.5 93.05,23 93,22.95 93.05,22.9 R1.2
  Bottom 0.152: v91.7,16.05 91.65,16 v75.9,16
MISO  (via drill 0.3)
  Top 0.152: 87.9,19.8 v87.9,19.7 87.85,19.85 87.85,20.7 87.35,21.2 87.35,21.9 v87.15,22.1 | v90.65,12 90.6,12.05 90.6,12.3 90.65,12.35 X2.P4 | U4.9 21,22.05 22.3,20.75 22.3,19.05 22.25,19 22.25,18.95 22.2,18.9 22.2,16.6 22.25,16.55 22.25,16.3 v23.65,14.9 | v42.2,14.9 43,14.9 43.1,15 43.4,15 44.9,16.5 v44.9,17.45 | v55.8,17.55 55.8,20.35 57.95,22.5 v57.95,22.75 | v93.05,12.15 93.6,12.15 94.35,12.9 94.35,15.85 v92.95,17.25
  Bottom 0.152: v87.9,19.7 90.45,19.7 91,19.15 91.05,19.15 91.8,18.4 91.8,18.35 92.9,17.25 v92.95,17.25 | v93.05,12.15 90.8,12.15 v90.65,12 | v23.65,14.9 v42.2,14.9 | v44.9,17.45 55.7,17.45 v55.8,17.55 | v57.95,22.75 58.75,22.75 59.15,23.15 74.75,23.15 75.6,22.3 86.95,22.3 v87.15,22.1
MOSI  (via drill 0.3)
  Top 0.152: X2.P5 90.25,16 90.5,16.25 90.5,18.5 87.7,21.3 87.7,24.6 v87.9,24.6 | v58.2,24.45 58.2,26.05 v57.4,26.85 | v41.8,23.4 v41.8,25.85 | v20.95,21 20.55,21.4 U4.8
  Bottom 0.152: v87.9,24.6 76.05,24.6 75.65,24.2 58.45,24.2 v58.2,24.45 | v57.4,26.85 42.8,26.85 v41.8,25.85 | v41.8,23.4 41.6,23.6 26.5,23.6 23.9,21 23,21 22.95,20.95 21,20.95 v20.95,21
N$1
  Top 0.3: U2.1 93.05,29.18 L1.1
N$2
  Top 0.3: U2.10 96,29.18 L1.2
N$4  (via drill 0.3)
  Top 0.3: R2.2 R3.1 94.85,35.8 v94.8,35.75 | v91.1,25.25 91.45,25.6 U2.3 | v88.85,25.35 88.85,34.05 v90.55,35.75
  Bottom 0.3: v91.1,25.25 91,25.15 89.05,25.15 v88.85,25.35 | v90.55,35.75 v94.8,35.75
N$6
  Top 0.3: R3.2 94.95,34.5 94.8,34.65 Q1.3
N$9
  Top 0.152: U4.5 R6.1
N$10  (via drill 0.3)
  Top 0.152: R10.1 61.2,35.7 60.8,35.7 60.75,35.75 60.5,35.75 v60.35,35.6 | v58.6,35.6 58.45,35.45 58.45,34.7 58.4,34.65 57.4,34.65 U1.7
  Bottom 0.152: v58.6,35.6 v60.35,35.6
N$11
  Top 0.152: U1.99 55.16,28.94 56.4,27.7 R9.1
N$19  (via drill 0.3)
  Top 0.152: C9.1 | U1.38 C7.1 | U1.67 | 35.7,37.8 C20.+
  Top 0.3: 59.15,34.15 U1.6 | 59.15,34.15 C9.1 | U1.67 C8.1 39.4,36.9 38.85,37.45 v38.9,37.5 38.85,37.6 v38.85,39.65 | v35.7,39.6 35.7,37.8 | L3.2 32.45,39.4 v32.65,39.6 | v49.9,40.95 49.9,44.3 49.7,44.5 49.7,44.65 49.65,44.7 U1.38 | v59.05,34.95 59.15,34.85 59.15,34.15
  Bottom 0.3: v35.7,39.6 35.75,39.65 | v32.65,39.6 v35.7,39.6 | 46.95,38 v49.9,40.95 | 46.95,38 39.65,38 39.3,37.65 38.95,37.65 38.9,37.6 v38.9,37.5 | v59.05,34.95 58.9,34.8 58.1,34.8 57.4,35.5 57.4,36.4 56.7,37.1 55.8,37.1 55,37.9 47.05,37.9 46.95,38 | v38.85,39.65 35.95,39.65 35.9,39.6 v35.7,39.6
N$20  (via drill 0.3)
  Top 0.152: U1.78 | C6.1 | C5.1 | C4.1 | U1.57 | 39.4,40.7 C3.1
  Top 0.3: C25.1 44.2,28.25 44.65,28.7 U1.78 | v58.6,40.14 U1.18 | v58.6,40.14 C6.1 | 54.15,46.8 U1.29 | 54.15,46.8 C5.1 | 47.16,46.6 U1.43 47.15,45.3 47.15,44.7 47.2,44.65 47.2,44.5 47.3,44.4 v47.3,44.15 | 47.16,46.6 C4.1 | C3.1 U1.57 | v35.55,46.05 C21.+ | 39.4,40.7 v39.4,44.05 39.4,46.1 v39.35,46.15 | L2.2 32.45,45.9 v32.6,46.05 | v54.2,46.8 54.15,46.8 | 47.16,46.6 v47.2,46.6 | v58.6,40.15 v58.6,40.14 | v44.1,44.05 44.15,43.95 44.15,31.35 44.65,30.85 44.65,30.05 U1.78
  Bottom 0.3: v32.6,46.05 v35.55,46.05 35.65,46.1 35.7,46.1 35.75,46.15 v39.35,46.15 | 44.1,44.15 v47.3,44.15 47.3,44.05 47.35,44 47.7,44 48.05,43.65 48.5,43.65 52,40.15 v58.6,40.15 | 44.1,44.15 39.35,44.15 v39.4,44.05 | v54.2,46.8 53.35,45.95 47.85,45.95 v47.2,46.6 | v44.1,44.05 44.1,44.15
N$21  (via drill 0.3)
  Top 0.152: C14.1 53.16,28.1 53.15,28.1 v53.15,28.75 | v47.3,28.65 47.35,28.65 | U1.84 | 46.85,27.95 C10.1 | L4.2 32.6,31.3 | 49.65,28.2 49.65,28.05 C12.1 49.8,28.05 49.65,28.2
  Top 0.3: 53.16,28.1 U1.95 | U1.88 v49.65,28.65 49.65,28.2 | 47.35,28.65 47.65,28.95 U1.84 | U1.82 46.65,28.85 46.85,28.65 | 46.85,28.65 v47.3,28.65 47.85,28.65 47.95,28.55 C11.1 | 46.85,28.65 46.85,27.95 | v37.05,31.3 C18.+ 32.6,31.3
  Bottom 0.152: v49.65,28.65 49.65,28.75
  Bottom 0.3: v49.65,28.65 v47.3,28.65 37.05,28.65 v37.05,31.3 | 49.65,28.75 v53.15,28.75
N$22  (via drill 0.3)
  Top 0.152: 54.15,28.4 U1.97 | 54.15,28.4 C17.1 | 54.15,28.4 54.15,28.7 v54.65,28.7 | v33.8,24.8 C19.+ 32.65,24.8 L5.2
  Top 0.3: v35.85,26.3 35.85,26.05 35.8,26 35.8,25.65 35.7,25.55 C19.+
  Bottom 0.3: v54.65,28.7 54.45,28.7 53.35,27.6 42.1,27.6 40.8,26.3 v35.85,26.3
N$31
  Top 0.152: R18.2 43.3,20 45.1,18.2 45.6,18.2 U$1.P$19
NCS  (via drill 0.3)
  Top 0.152: v89.45,16.9 89.1,16.9 87.5,18.5 v87.5,18.95 | v82.9,19 82.55,19 81.8,19.75 v81.8,21.55 | v14.8,16.3 14.8,20.5 15.3,21 15.3,21.55 14.8,22.05 U4.6 | U4.6 | v89.85,11.95 X2.P8
  Bottom 0.152: v89.85,11.95 89.85,13 92.55,15.7 92.55,16.4 92.05,16.9 v89.45,16.9 | v87.5,18.95 87.45,19 v82.9,19 | v81.8,21.55 64.95,21.55 61.6,18.2 51.4,18.2 51.3,18.1 43.15,18.1 43.1,18.15 42.9,18.15 42.85,18.2 42.45,18.2 42.4,18.15 42,18.15 41.7,17.85 41.65,17.85 39.35,15.55 25,15.55 24.8,15.75 24.4,15.75 24.2,15.55 15.55,15.55 v14.8,16.3
P1.1
  Top 0.152: U4.3 15.05,24 15.3,23.75 15.3,22.05 18.5,18.85 18.5,17.75 X5.3 | U4.3
RED0  (via drill 0.3)
  Top 0.152: X2.P19 87.45,16.05 85.5,18 85.5,30.15 83.2,32.45 83.2,44.95 83.45,45.2 83.45,46.45 v83.15,46.75 | v53.05,47.35 53.05,47.15 53.7,46.5 53.7,45.43 U1.30
  Bottom 0.152: v83.15,46.75 82.95,46.75 82.65,47.05 82.2,47.05 81.7,46.55 61.1,46.55 59.95,47.7 53.4,47.7 v53.05,47.35
RED1  (via drill 0.3)
  Top 0.152: v87.95,9.8 87.95,10.6 87.7,10.85 87.7,12.05 87.85,12.2 X2.P18 | v54.65,33.55 54.65,43.1 53.55,44.2 53.55,44.25 53.15,44.65 53.15,45.35 U1.31 | v59.15,33.35 59.15,32.65 v59.65,32.15 | v66.45,16.75 v66.45,26.8
  Bottom 0.152: v87.95,9.8 87.95,10.6 87.7,10.85 87.7,12.05 87.6,12.15 87.15,12.6 86.55,12.6 85,14.15 74.2,14.15 71.6,16.75 v66.45,16.75 | v54.65,33.55 58.95,33.55 v59.15,33.35 | v59.65,32.15 59.85,32.35 63.95,32.35 66.45,29.85 v66.45,26.8
RED2  (via drill 0.3)
  Top 0.152: X2.P17 87.85,16.15 85.85,18.15 85.85,30.3 83.6,32.55 83.6,44.75 83.95,45.1 83.95,46.9 v83.35,47.5 | v52.6,48.25 52.6,47.8 52.4,47.6 52.4,46.95 52.65,46.7 U1.32
  Bottom 0.152: v83.35,47.5 82.15,47.5 81.6,46.95 61.3,46.95 59.95,48.3 52.65,48.3 v52.6,48.25
RED3  (via drill 0.3)
  Top 0.152: X2.P16 88.25,12.05 88.05,11.85 88.05,11.5 v88.3,11.25 | v54,34.4 54,42.8 52.15,44.65 52.15,45.35 U1.33 | v60.45,33.25 60.45,33.2 60.55,33.1 v60.55,31.8 | v65.9,29.6 65.95,29.55 65.95,27.5 65.6,27.15 65.6,17.8 v65.8,17.6
  Bottom 0.152: v88.3,11.25 88.05,11.5 88.05,11.85 88.25,12.05 88.25,12.45 87.65,13.05 86.6,13.05 85.15,14.5 74.8,14.5 71.7,17.6 v65.8,17.6 | v54,34.4 59.3,34.4 v60.45,33.25 | v60.55,31.8 60.75,32 63.85,32 65.9,29.95 v65.9,29.6
RED4  (via drill 0.3)
  Top 0.152: X2.P14 88.65,11.75 88.85,11.55 88.85,11 88.55,10.7 v88.55,10.45 | v53,42.85 51.55,44.3 51.55,44.5 51.65,44.6 51.65,45.35 U1.34 | v63.45,27.7 v63.45,39.5 | v64.95,18.45 v64.95,26.8
  Bottom 0.152: v88.55,10.45 88.55,10.7 88.85,11 88.85,11.55 88.6,11.8 88.6,12.55 87.75,13.4 86.7,13.4 85.2,14.9 75.3,14.9 71.75,18.45 v64.95,18.45 | v63.45,39.5 59.55,43.4 55.8,43.4 55.25,42.85 v53,42.85 | v63.45,27.7 64.35,26.8 v64.95,26.8
RED5  (via drill 0.3)
  Top 0.152: X2.P13 88.65,15.85 86.2,18.3 86.2,30.45 84,32.65 84,44.55 84.4,44.95 84.4,47.3 83.5,48.2 82.05,48.2 v81.35,47.5 | v51.15,47.7 U1.35
  Bottom 0.152: v81.35,47.5 61.3,47.5 59.9,48.9 52.4,48.9 51.15,47.65 v51.15,47.7
RED6  (via drill 0.3)
  Top 0.152: X2.P12 89.05,11.85 89.2,11.7 89.2,10.05 v88.95,9.8 | v50.9,44.15 50.9,44.35 50.65,44.6 50.65,45.35 U1.36 | v64.3,39.8 64.3,26.35 64.25,26.3 64.25,19.35 v64.3,19.3
  Bottom 0.152: v88.95,9.8 89.2,10.05 89.2,12.45 87.9,13.75 86.8,13.75 85.3,15.25 75.5,15.25 74.8,15.95 71.55,19.25 71.5,19.3 v64.3,19.3 | v50.9,44.15 51.35,43.7 53.1,43.7 53.45,43.35 55.2,43.35 55.65,43.8 59.8,43.8 59.9,43.7 60.4,43.7 v64.3,39.8
RED7  (via drill 0.3)
  Top 0.152: X2.P11 89.05,15.95 86.6,18.4 86.6,30.55 84.35,32.8 84.35,44.45 84.75,44.85 84.75,47.45 83.65,48.55 81.85,48.55 81.35,48.05 80.9,48.05 v80.8,48.1 | v50.3,46.9 50.3,46.5 50.2,46.4 50.2,45.41 U1.37
  Bottom 0.152: v80.8,48.1 80.7,48 80.05,48 61.4,47.95 59.8,49.55 51.9,49.55 50.55,48.2 50.55,47.15 v50.3,46.9
RESET  (via drill 0.3)
  Top 0.152: U4.2 15.1,24.65 15.4,24.95 v15.4,25.55 | v29.3,25.35 v29.3,21.3 | v40.7,19.55 40.7,18.55 41.2,18.05 42,18.05 42.15,18.2 43.3,18.2 44.35,17.15 v44.35,16.9 | v55.35,16.9 55.35,17.2 55.25,17.3 55.25,17.8 55.35,17.9 55.35,19.3 v55.25,19.4 | v74.95,22.15 77.65,22.15 v78.7,23.2 | v83.5,23.2 v83.5,20.6 | v87.15,20.6 86.95,20.4 86.95,18.5 89.45,16 X2.P9 | U4.2
  Bottom 0.152: v15.4,25.55 16.2,25.55 16.6,25.15 29.1,25.15 v29.3,25.35 | v29.3,21.3 38.95,21.3 v40.7,19.55 | v44.35,16.9 45.15,16.9 45.35,17.1 55.15,17.1 v55.35,16.9 | v55.25,19.4 61.95,19.4 62.25,19.7 62.25,19.75 65.3,22.8 74.3,22.8 v74.95,22.15 | v78.7,23.2 78.9,23 83.3,23 v83.5,23.2 | v83.5,20.6 v87.15,20.6
RST  (via drill 0.3)
  Top 0.152: v14,19.8 13.45,19.25 X5.5 | v18.8,21.1 18.8,22.45 18.95,22.6 19.1,22.6 19.2,22.7 U4.10 21.6,22.7 21.8,22.9 22.2,22.9 R5.1 C22.1
  Bottom 0.152: v14,19.8 15.6,19.8 15.65,19.85 17.55,19.85 v18.8,21.1
SCLK  (via drill 0.3)
  Top 0.152: 89.4,22.75 91.05,21.1 v91.05,18.3 | 89.4,22.75 89.3,22.85 | v89.95,18.25 90.15,18.05 90.15,16.35 89.85,16.05 X2.P7 | v89.35,22.65 89.35,22.7 89.4,22.75 | v13.05,24.45 12.7,24.45 12,23.75 12,23.4 11.95,23.35 11.95,23.3 11.9,23.25 11.9,22.15 12.5,21.55 13.1,21.55 13.1,21.45 13.15,21.4 U4.7
  Bottom 0.152: v91.05,18.3 91,18.25 v89.95,18.25 | v89.35,22.65 76.85,22.65 75.65,23.85 55,23.85 54.8,24.05 51.95,24.05 51.75,24.25 29.85,24.25 29.65,24.45 26.45,24.45 26.15,24.15 15.6,24.15 15.3,24.45 v13.05,24.45
SYS_5V  (via drill 0.3)
  Top 0.152: R18.1 42,21.3 41.55,20.85 v41.55,18.9
  Top 0.3: U5.3 26.35,35.95 C15.1 27.1,35.95 27.4,35.65 v27.4,35.35 | v45.85,18.95 45.95,18.85 45.95,18.7 46.1,18.55 U$1.P$18 | 92.15,26.1 U2.2 | R18.1 42.65,21.3 v42.65,25.5 42.75,25.6 42.75,26.25 v41.15,27.85 | 92.15,26.1 91.3,26.1 C1.1 | v92.15,26.25 92.15,26.1 | v95.95,24 95.95,24.6 U2.6 96,24.75 U2.7 | v30.4,35.35 30.4,35.3 30.8,34.9 30.8,28.05 v30.65,27.9
  Bottom 0.152: v41.55,18.9 41.55,18.85
  Bottom 0.3: 41.55,18.85 45.75,18.85 v45.85,18.95 | 92.15,26.1 43.3,26.15 v42.65,25.5 | v95.95,24 94.35,25.6 92.6,25.6 92.15,26.1 | 92.15,26.1 v92.15,26.25 | v27.4,35.35 27.55,35.5 30.25,35.5 v30.4,35.35 | v41.15,27.85 31.75,27.85 31.7,27.9 v30.65,27.9
TEST  (via drill 0.3)
  Top 0.152: X5.6 10.9,19.25 10.3,19.85 v10.3,22.75 | v18.85,23.15 19.05,23.35 U4.11
  Bottom 0.152: v10.3,22.75 18.45,22.75 v18.85,23.15
TMDS_CLOCK+  (via drill 0.3)
  Top 0.152: U$1.P$10 50.15,19.1 53.7,22.65 55.2,22.65 v56.05,21.8 | U1.93 52.14,28.89 52,28.75 52,22.95 v51.7,22.65
  Bottom 0.152: v51.7,22.65 55.2,22.65 v56.05,21.8
TMDS_CLOCK-  (via drill 0.3)
  Top 0.152: U$1.P$12 49.15,18.6 53.55,23 56,23 v56.55,22.45 | v52.6,23.2 52.6,29 52.7,29.1 52.7,29.88 U1.94
  Bottom 0.152: v56.55,22.45 55.8,23.2 v52.6,23.2
TMDS_DATA0+  (via drill 0.3)
  Top 0.152: v51.5,19.6 51.65,19.45 U$1.P$7 | v47.5,19.35 47.6,19.55 48.3,19.55 50.35,21.6 50.35,22.35 50.25,22.45 49.85,22.45 49.7,22.6 49.7,23 49.85,23.15 50.55,23.15 50.65,23.25 50.65,23.6 50.55,23.7 49.75,23.7 49.65,23.8 49.65,24.25 49.8,24.4 50.55,24.4 50.65,24.5 50.65,29.92 U1.90
  Bottom 0.152: v51.5,19.6 51.4,19.55 47.6,19.55 v47.5,19.35
TMDS_DATA0-  (via drill 0.3)
  Top 0.152: U$1.P$9 50.65,18.55 v51,19 | v46.7,19.45 47.15,18.8 48.4,18.8 51.15,21.55 51.15,21.8 51.05,21.9 50.85,21.9 50.7,22.05 50.7,22.8 50.8,22.9 51,22.9 51.15,23.05 U1.91
  Bottom 0.152: v46.7,19.45 47.05,18.95 47.15,18.8 48.65,18.8 48.85,19 v51,19
TMDS_DATA1+  (via drill 0.3)
  Top 0.152: U$1.P$4 53.15,20.35 53.7,20.9 54.25,20.9 v54.65,21.3 | v47.85,21.05 48,21.05 48.65,21.7 48.65,28.4 48.15,28.9 U1.85
  Bottom 0.152: v47.85,21.05 48.05,20.85 53.8,20.85 54.25,21.3 v54.65,21.3
TMDS_DATA1-  (via drill 0.3)
  Top 0.152: U$1.P$6 52.15,20.35 53.9,22.1 v54.8,22.1 | v49.15,21.4 49.15,21.65 49,21.8 49,28.6 48.65,28.95 48.65,29.92 U1.86
  Bottom 0.152: v54.8,22.1 54.4,22.1 53.5,21.2 49.35,21.2 v49.15,21.4
TMDS_DATA2+  (via drill 0.3)
  Top 0.152: v54.65,20.5 U$1.P$1 | v45.65,20.55 45.65,29.92 U1.80
  Bottom 0.152: v54.65,20.5 45.65,20.5 v45.65,20.55
TMDS_DATA2-  (via drill 0.3)
  Top 0.152: v53.9,19.95 53.9,19.85 53.65,19.65 U$1.P$3 | v45.85,19.8 46.2,20.15 46.2,20.9 46.05,21.05 46.05,28.55 46.15,28.65 U1.81
  Bottom 0.152: v45.85,19.8 46.2,20.15 53.7,20.15 v53.9,19.95
VDD  (via drill 0.3)
  Top 0.152: R16.2 R17.2 | U3.8 15.85,35.5 | U3.8 15.9,35.55 | L5.1 32.7,22.6 | 31.3,26.95 v31.35,26.95 | 13.1,25.3 11.4,23.6 11.4,23.35 11.2,23.15 R6.2 11.2,22.15 11.25,22.1 11.25,22 11.3,21.95 v11.3,21.75 | 14.1,25.3 U4.1 14.2,25.25 14.25,25.3 14.25,25.35 14.2,25.4 | v23.4,21.7 23.5,21.7 | U3.8 16,35.5
  Top 0.3: L3.1 31.75,35.75 31.4,36.1 | 31.4,36.1 31.3,36.2 31.3,38.1 | 31.3,38.1 31.3,41.45 | 31.3,41.45 31.3,42.05 31.55,42.3 | 31.55,42.3 31.7,42.45 L2.1 | L4.1 31.75,29.15 31.4,29.5 | 31.4,29.5 31.3,29.6 31.3,36 | 31.3,36 31.4,36.1 | 31.6,22.75 31.75,22.6 L5.1 33.3,22.6 v33.45,22.45 | 31.6,22.75 31.3,23.05 31.3,26.95 31.3,29.4 31.4,29.5 | v25.3,35.95 25.05,35.7 C16.1 23.25,35.7 v22.8,35.25 | 31.3,38.1 v31.2,38.1 | v25.1,42.8 25.1,43.05 25.05,43.1 25.05,43.4 25,43.45 25,44.25 24.95,44.3 U5.4 | 31.55,42.3 v31.45,42.4 | v55.25,24.8 55.45,25 R9.2 57.2,25 v57.35,25.15 | v62.5,37.5 R10.2 | v61.55,24.85 v61.55,29.75 | v65,30 65.05,30.05 65.05,34.8 65,34.85 v65,35.05 68.05,38.1 68.2,38.1 v69.05,38.95 | v21.45,19.75 21.2,19.5 21.2,19.25 21.05,19.1 X5.2 | 31.6,22.75 v31.45,22.6 | v23.5,20.15 23.5,21.7 R5.2 | 13.1,25.3 14.1,25.3 | 14.2,25.4 C23.1 C24.1 14.2,34.8 14.9,35.5 15.7,35.5 U3.8 15.9,35.59 C13.1 | v93.3,38.3 R4.2 | v75.45,38.3 v72.7,38.3 72.55,38.45 72.55,38.65 v72.25,38.95 | 16,35.5 17.6,35.5 v17.85,35.25 19.4,33.7 R16.2 | v48,24.95 46.75,23.7 v46.75,22.45 | v31.25,36 31.3,36 | 31.3,41.45 v31.2,41.45 | v30.25,22 30.25,20.1 29.65,19.5 29.65,19.15 29.5,19 X3.1
  Bottom 0.152: v23.4,21.7 23.35,21.75 v11.3,21.75
  Bottom 0.3: v65,35.05 64.95,35.05 v62.5,37.5 | v57.35,25.15 61.25,25.15 v61.55,24.85 | v61.55,29.75 61.8,30 v65,30 | v21.45,19.75 21.75,20.05 23.5,20.05 v23.5,20.15 | v75.45,38.3 v93.3,38.3 | v69.05,38.95 v72.25,38.95 | v48,24.95 49.4,24.95 49.6,24.75 50.1,24.75 50.3,24.95 52.85,24.95 53.1,24.7 53.6,24.7 53.65,24.75 55.2,24.75 v55.25,24.8 | v33.45,22.45 v46.75,22.45 | v17.85,35.25 v22.8,35.25 | v31.25,36 25.55,36 25.5,35.95 v25.3,35.95 | v31.2,41.45 26.7,41.45 25.5,42.65 25.45,42.65 25.3,42.8 v25.1,42.8 | v31.45,22.6 31.25,22.6 31.05,22.4 30.95,22.4 30.55,22 v30.25,22
VSYNC  (via drill 0.3)
  Top 0.152: v45.25,46.6 45.25,46.2 45.15,46.1 45.15,45.4 U1.47 | v72.7,32.6 72.7,19.3 v72.9,19.1 | v81.6,16.65 81.7,16.65 81.95,16.4 81.95,15.75 82.2,15.5 82.2,15.45 82.25,15.4 X2.P45
  Bottom 0.152: v45.25,46.6 46.85,45 55,45 55.3,45 55.55,45.25 57.7,45.25 57.9,45.05 60.25,45.05 v72.7,32.6 | v72.9,19.1 79.5,19.1 79.9,18.7 79.9,18.15 81.4,16.65 v81.6,16.65

### Text on the board
tNames: Replicape display | Rev A1